# Altium schematic sheet LIDO-HW.100.VinAndPower.SchDoc
size A3; SheetNumber: 6; SheetTotal: 17
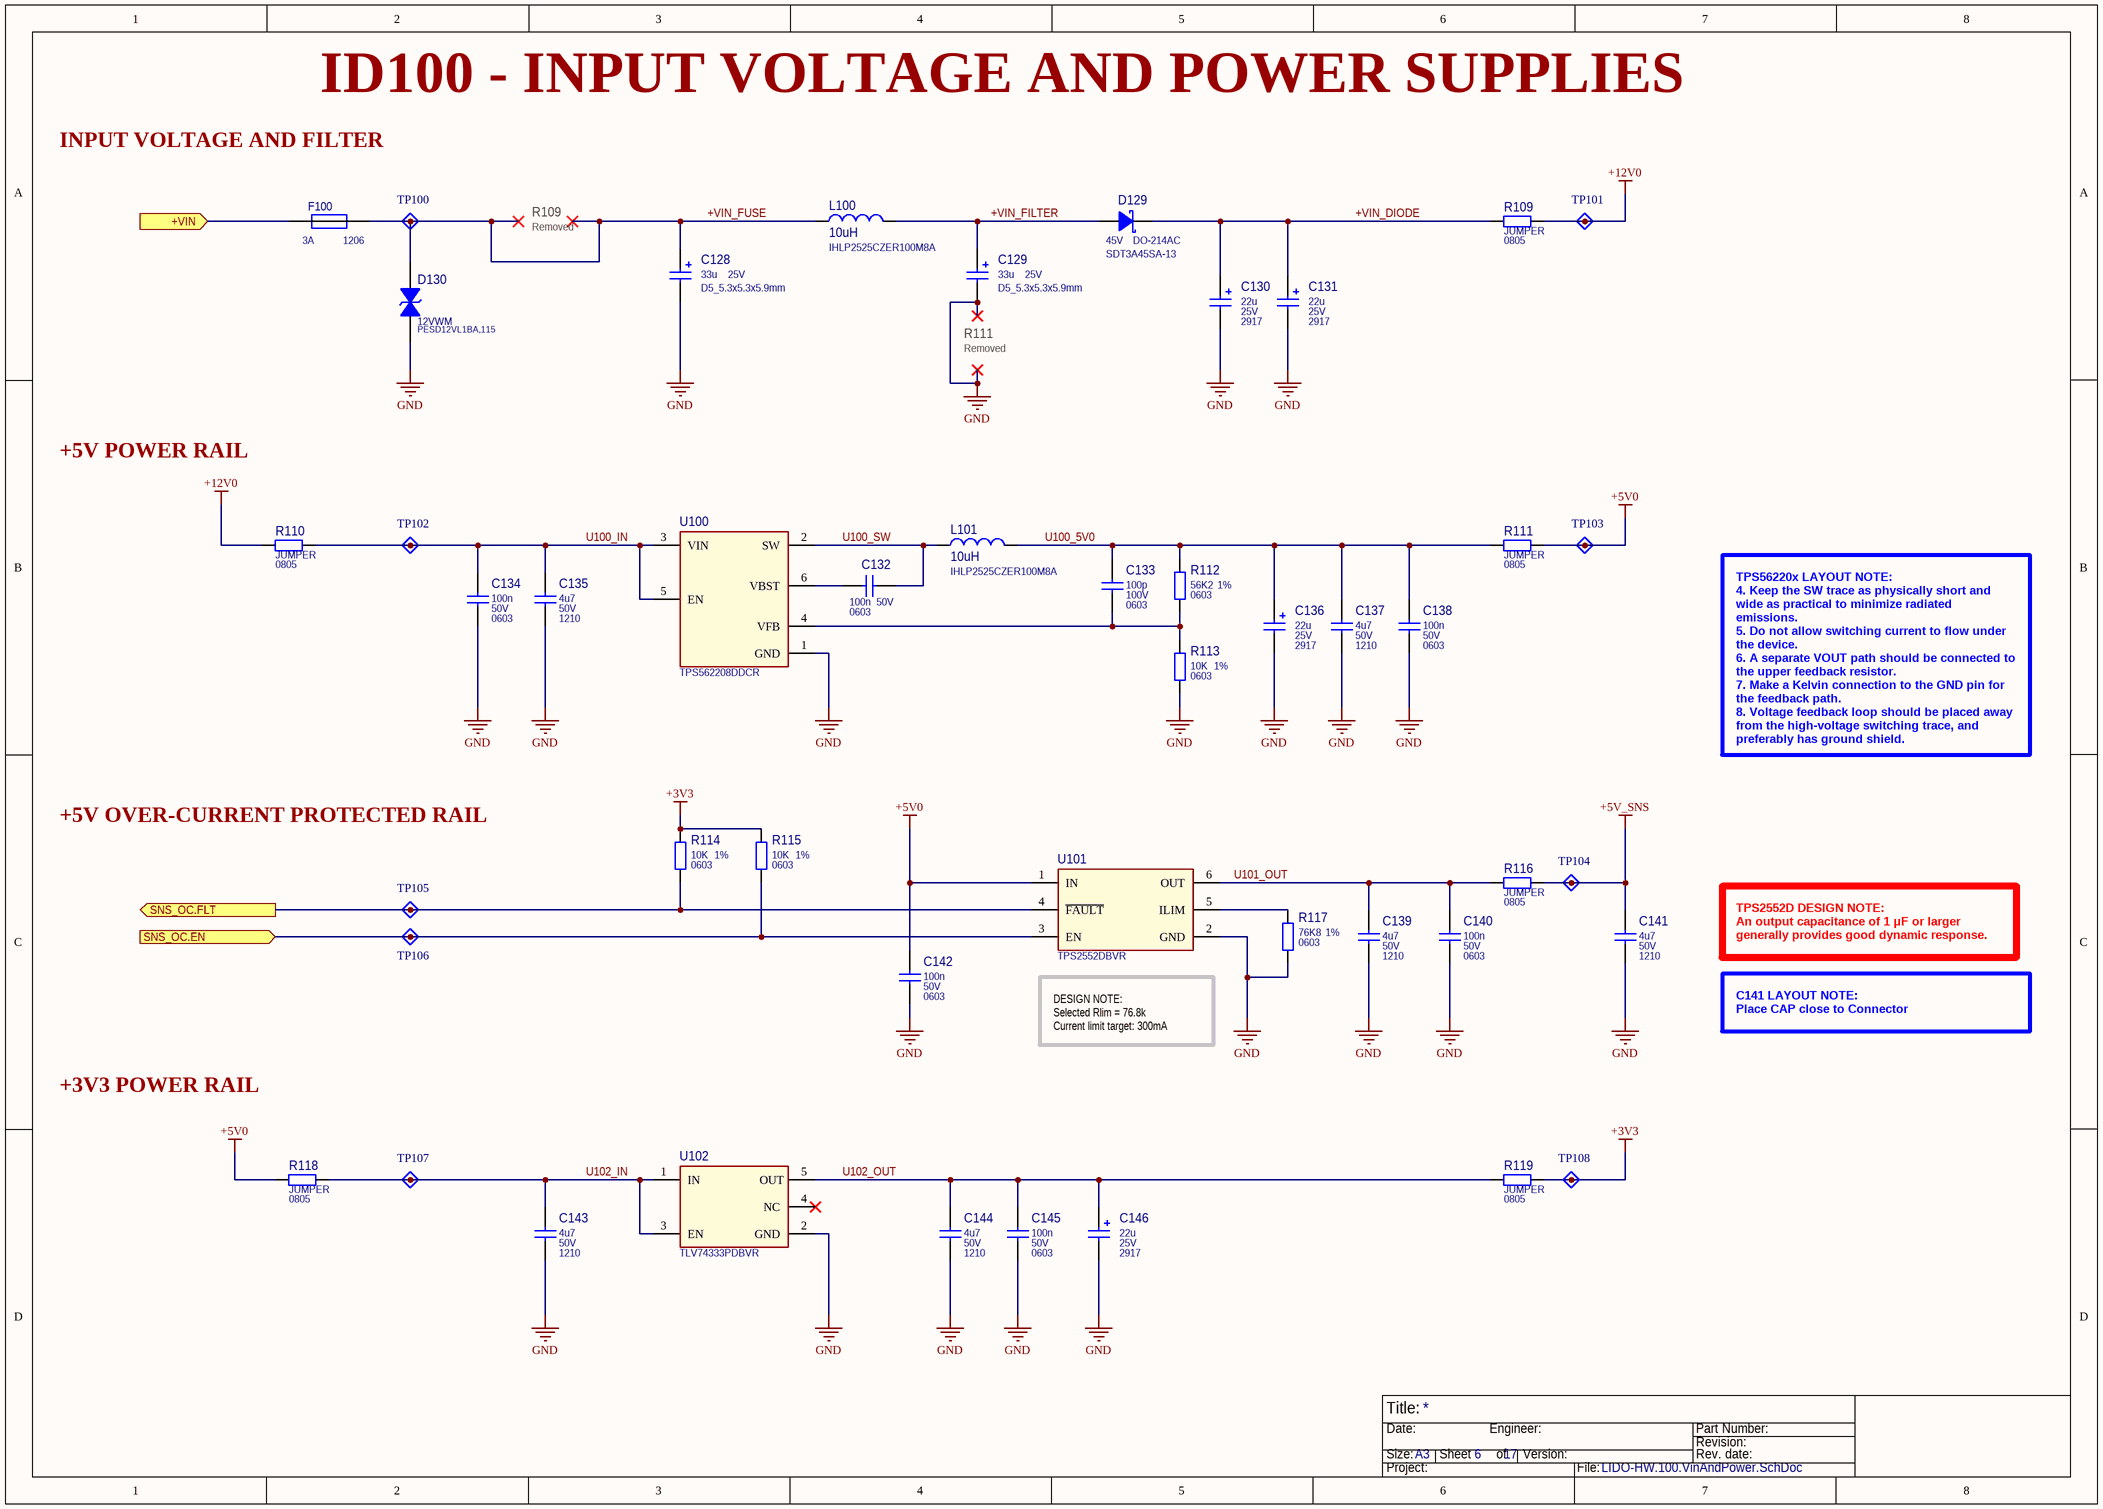
[diagram p0: LIDO-HW.100.VinAndPower.SchDoc]

## Parts
C128  33u  Part Value 2: 25V  Part Package: D5_5.3x5.3x5.9mm  [CAPAE_C_530X590L22X7-N_PANASONIC_A]
C129  33u  Part Value 2: 25V  Part Package: D5_5.3x5.3x5.9mm  [CAPAE_C_530X590L22X7-N_PANASONIC_A]
C130  22u  Part Value 2: 25V  Part Package: 2917  [CAP_2917_7343X140-N_MURATA_A]
C131  22u  Part Value 2: 25V  Part Package: 2917  [CAP_2917_7343X140-N_MURATA_A]
C132  100n  Part Value 2: 50V  Part Package: 0603  [CAP_0603_1608X90-N_MURATA_A]
C133  100p  Part Value 2: 100V  Part Package: 0603  [CAP_0603_1608X90-N_MURATA_A]
C134  100n  Part Value 2: 50V  Part Package: 0603  [CAP_0603_1608X90-N_MURATA_A]
C135  4u7  Part Value 2: 50V  Part Package: 1210  [CAP_1210_3225X180-N_MURATA_A]
C136  22u  Part Value 2: 25V  Part Package: 2917  [CAP_2917_7343X140-N_MURATA_A]
C137  4u7  Part Value 2: 50V  Part Package: 1210  [CAP_1210_3225X180-N_MURATA_A]
C138  100n  Part Value 2: 50V  Part Package: 0603  [CAP_0603_1608X90-N_MURATA_A]
C139  4u7  Part Value 2: 50V  Part Package: 1210  [CAP_1210_3225X180-N_MURATA_A]
C140  100n  Part Value 2: 50V  Part Package: 0603  [CAP_0603_1608X90-N_MURATA_A]
C141  4u7  Part Value 2: 50V  Part Package: 1210  [CAP_1210_3225X180-N_MURATA_A]
C142  100n  Part Value 2: 50V  Part Package: 0603  [CAP_0603_1608X90-N_MURATA_A]
C143  4u7  Part Value 2: 50V  Part Package: 1210  [CAP_1210_3225X180-N_MURATA_A]
C144  4u7  Part Value 2: 50V  Part Package: 1210  [CAP_1210_3225X180-N_MURATA_A]
C145  100n  Part Value 2: 50V  Part Package: 0603  [CAP_0603_1608X90-N_MURATA_A]
C146  22u  Part Value 2: 25V  Part Package: 2917  [CAP_2917_7343X140-N_MURATA_A]
D129  45V  Manufacturer Part Number: SDT3A45SA-13  Part Package: DO-214AC  [DIOM519X260X240L114X145-N_WURTH_A]
D130  Manufacturer Part Number: PESD12VL1BA,115  [NXP_SOD-323_250X125X95L30x32_A]  (hidden comment: 12VWM)
F100  3A  Part Package: 1206  [FUSE_1206-N_YAGEO_A]
L100  10uH  Manufacturer Part Number: IHLP2525CZER100M8A  [VISHAY_IHLP2525CZ_647X647X300_A]
L101  10uH  Manufacturer Part Number: IHLP2525CZER100M8A  [VISHAY_IHLP2525CZ_647X647X300_A]
R109  JUMPER  Part Package: 0805  [RES_0805_2012X65-N_YAGEO_A]
R110  JUMPER  Part Package: 0805  [RES_0805_2012X65-N_YAGEO_A]
R111  JUMPER  Part Package: 0805  [RES_0805_2012X65-N_YAGEO_A]
R112  56K2  Part Value 2: 1%  Part Package: 0603  [RES_0603_1608X60-N_YAGEO_A]
R113  10K  Part Value 2: 1%  Part Package: 0603  [RES_0603_1608X60-N_YAGEO_A]
R114  10K  Part Value 2: 1%  Part Package: 0603  [RES_0603_1608X60-N_YAGEO_A]
R115  10K  Part Value 2: 1%  Part Package: 0603  [RES_0603_1608X60-N_YAGEO_A]
R116  JUMPER  Part Package: 0805  [RES_0805_2012X65-N_YAGEO_A]
R117  76K8  Part Value 2: 1%  Part Package: 0603  [RES_0603_1608X60-N_YAGEO_A]
R118  JUMPER  Part Package: 0805  [RES_0805_2012X65-N_YAGEO_A]
R119  JUMPER  Part Package: 0805  [RES_0805_2012X65-N_YAGEO_A]
TP100  TestPoint_A  [TESTPOINT_1D_A]  (value not drawn)  (no BOM)
TP101  TestPoint_A  [TESTPOINT_1D_A]  (value not drawn)  (no BOM)
TP102  TestPoint_A  [TESTPOINT_1D_A]  (value not drawn)  (no BOM)
TP103  TestPoint_A  [TESTPOINT_1D_A]  (value not drawn)  (no BOM)
TP104  TestPoint_A  [TESTPOINT_1D_A]  (value not drawn)  (no BOM)
TP105  TestPoint_A  [TESTPOINT_1D_A]  (value not drawn)  (no BOM)
TP106  TestPoint_A  [TESTPOINT_1D_A]  (value not drawn)  (no BOM)
TP107  TestPoint_A  [TESTPOINT_1D_A]  (value not drawn)  (no BOM)
TP108  TestPoint_A  [TESTPOINT_1D_A]  (value not drawn)  (no BOM)
U100  TPS562208DDCR  [SOT23-6P95_280X145L45-N_MICROCHIP_A]
U101  TPS2552DBVR  [SOT23-6P95_280X145L45-N_MICROCHIP_A]
U102  TLV74333PDBVR  [SOT23-5P95_280X145L45-N_TI_A]

## Ports
+VIN (in), SNS_OC.EN (in), SNS_OC.FLT (out)

## Nets
+3V3: R114.2 R115.2 R119.2 TP108.1(TP)
+5V0: C142.2 R111.2 R118.1 TP103.1(TP) U101.1(IN)
+5V_SNS: C141.1 R116.2 TP104.1(TP)
+12V0: R109.2 R110.1 TP101.1(TP)
GND: C128.2 C129.2 C130.2 C131.2 C134.1 C135.2 C136.2 C137.2 C138.1 C139.2 C140.1 C141.2 C142.1 C143.2 C144.2 C145.1 C146.2 D130.C R113.1 R117.1 U100.1(GND) U101.2(GND) U102.2(GND)
+VIN: F100.1 ; port +VIN
+VIN_DIODE: C130.1 C131.1 D129.C R109.1
+VIN_FILTER: C129.1 D129.A L100.2
+VIN_FUSE: C128.1 D130.A F100.2 L100.1 TP100.1(TP)
SNS_OC.EN: R115.1 TP106.1(TP) U101.3(EN) ; port SNS_OC.EN
SNS_OC.FLT: R114.1 TP105.1(TP) U101.4(~{FAULT}) ; port SNS_OC.FLT
U100_5V0: C133.1 C136.1 C137.1 C138.2 L101.2 R111.1 R112.2
U100_IN: C134.2 C135.1 R110.2 TP102.1(TP) U100.3(VIN) U100.5(EN)
U100_SW: C132.2 L101.1 U100.2(SW)
U101_OUT: C139.1 C140.2 R116.1 U101.6(OUT)
U102_IN: C143.1 R118.2 TP107.1(TP) U102.1(IN) U102.3(EN)
U102_OUT: C144.1 C145.2 C146.1 R119.1 U102.5(OUT)
NetC132_1: C132.1 U100.6(VBST)
NetC133_2: C133.2 R112.1 R113.2 U100.4(VFB)
NetR117_2: R117.2 U101.5(ILIM)

Not connected (* = marked no-connect by the designer): U102 4(NC)*

## Notes on the sheet
- ID100 - INPUT VOLTAGE AND POWER SUPPLIES
- INPUT VOLTAGE AND FILTER
- Removed
- R109
- (near C129) R111
- +5V POWER RAIL
- TPS56220x LAYOUT NOTE:
  4. Keep the SW trace as physically short and wide as practical to minimize radiated emissions.
  5. Do not allow switching current to flow under the device.
  6. A separate VOUT path should be connected to the upper feedback resistor.
  7. Make a Kelvin connection to the GND pin for the feedback path.
  8. Voltage feedback loop should be placed away from the high-voltage switching trace, and preferably has ground shield.
- +5V OVER-CURRENT PROTECTED RAIL
- TPS2552D DESIGN NOTE:
  An output capacitance of 1 μF or larger generally provides good dynamic response.
- DESIGN NOTE:
  Selected Rlim = 76.8k
  Current limit target: 300mA
- C141 LAYOUT NOTE:
  Place CAP close to Connector
- +3V3 POWER RAIL
- Title:
- Size:
- Date:
- A3
- Sheet       of
- Engineer:
- Version:
- Part Number:
- Revision:
- Rev. date:
- Project:
- File:

## Library data of the parts
C128 C129 = 86: CAP ALUM POLY 33UF 20% 25V SMD; Manufacturer Part Number: 25SVPK33M; Manufacturer: Panasonic Electronic Components; Obsolete Part: False; Component ID: 86; Part Value: 33u; Part Value 3: 20%; Package Type: SMT
C130 C131 C136 C146 = 87: CAP ALUM POLY 22UF 20% 25V SMD; Manufacturer Part Number: ECASD31E226M040KA0; Manufacturer: Murata Electronics; Obsolete Part: False; Component ID: 87; Part Value: 22u; Part Value 3: 20%; Package Type: SMT
C132 C134 C138 C140 C142 C145 = 77: CAP CER 0.1UF 50V X7R 0603; Manufacturer Part Number: CGA3E2X7R1H104K080AA; Manufacturer: TDK Corporation; Obsolete Part: False; Component ID: 77; Part Value: 100n; Part Value 3: X7R; Package Type: SMT
C133 = 75: CAP CER 100PF 100V C0G 0603; Manufacturer Part Number: CGA3E2C0G2A101J080AA; Manufacturer: TDK Corporation; Obsolete Part: False; Component ID: 75; Part Value: 100p; Part Value 3: 5%; Package Type: SMT
C135 C137 C139 C141 C143 C144 = 91: CAP CER 4.7UF 50V X7R 1210; Manufacturer Part Number: CL32B475KBJVPNE; Manufacturer: Samsung Electro-Mechanics; Obsolete Part: False; Component ID: 91; Part Value: 4u7; Part Value 3: X7R; Package Type: SMT
D129 = 16: SCHOTTKY RECTIFIER SMA T&R 10K; Manufacturer: Diodes Incorporated; Obsolete Part: False; Component ID: 16; Part Value: 45V; Part Value 2: 3A; Package Type: SMT
D130 = 33: 37V Clamp 5A (8/20µs) Ipp Tvs Diode Surface Mount SOD-323; Manufacturer: Nexperia USA Inc.; Part Package: SOD323; Obsolete Part: False; Component ID: 33; Part Type: TVS; Part Value: 12VWM; Package Type: SMT
F100 = 35: 3 A 125 V AC 63 V DC Fuse Board Mount (Cartridge Style Excluded) Surface Mount 1206 (3216 Metric); Manufacturer Part Number: C1Q 3; Manufacturer: Bel Fuse Inc.; Obsolete Part: False; Component ID: 35; Part Type: FUSE; Part Value: 3A; Package Type: SMT
L100 L101 = 25: FIXED IND 10UH 4A 76.9 MOHM SMD; Manufacturer: Vishay Dale; Part Package: 6.47x6.47x3.0mm; Obsolete Part: False; Component ID: 25; Part Value: 10uH; Part Value 2: 20%; Part Value 3: 4A; Package Type: SMT
R109-R111 R116 R118 R119 = 97: RES SMD 0 OHM JUMPER 1/8W 0805; Manufacturer Part Number: ERJ-6GEY0R00V; Manufacturer: Panasonic Electronic Components; Obsolete Part: False; Component ID: 97; Part Value: JUMPER; Part Value 2: %; Part Value 3: 1/8W; Package Type: SMT
R112 = 101: RES SMD 56.2K OHM 1% 1/10W 0603; Manufacturer Part Number: ERJ-3EKF5622V; Manufacturer: Panasonic Electronic Components; Obsolete Part: False; Component ID: 101; Part Value: 56K2; Part Value 3: 1/10W; Package Type: SMT
R113-R115 = 115: RES 10K OHM 1% 1/10W 0603; Manufacturer Part Number: RC0603FR-0710KL; Manufacturer: YAGEO; Obsolete Part: False; Component ID: 115; Part Value: 10K; Part Value 3: 1/10W; Package Type: SMT
R117 = 102: RES SMD 76.8K OHM 1% 1/10W 0603; Manufacturer Part Number: ERJ-3EKF7682V; Manufacturer: Panasonic Electronic Components; Manufacturer Part Number 2nd: RMCF0603FT76K8; Manufacturer 2nd: Stackpole Electronics Inc; Obsolete Part: False; Component ID: 102; Part Value: 76K8; Part Value 3: 1/10W; Package Type: SMT
TP100-TP108 = 3: Pad Diamater 1mm; Part: Test Point 1D A; Obsolete Part: False; 00_Name: TP_XXmm; Component ID: 3; 02_Layer: *; 01_Diameter: 1mm
U100 = 32: Buck Switching Regulator IC Positive Adjustable 0.768V 1 Output 2A SOT-23-6 Thin, TSOT-23-6; Manufacturer: Texas Instruments; Part Package: SOT23-6; Obsolete Part: False; Component ID: 32; Manufacturer Part Number: TPS562208DDCR; Part Type: Buck; Part Value: TPS562208; Package Type: SMT
U101 = 33: Power Switch/Driver 1:1 N-Channel 1.5A SOT-23-6; Manufacturer: Texas Instruments; Part Package: SOT23-6; Obsolete Part: False; Component ID: 33; Manufacturer Part Number: TPS2552DBVR; Part Type: Power Switch; Part Value: TPS2552D; Package Type: SMT
U102 = 34: Linear Voltage Regulator IC Positive Fixed 1 Output 300mA SOT-23-5; Manufacturer: Texas Instruments; Part Package: SOT23-5; Obsolete Part: False; Component ID: 34; Manufacturer Part Number: TLV74333PDBVR; Part Type: LDO 5V 50mA; Part Value: TLV74333PD; Package Type: SMT